# EAGLE schematic RGB-LED-dimmer (EAGLE 7.4.0)
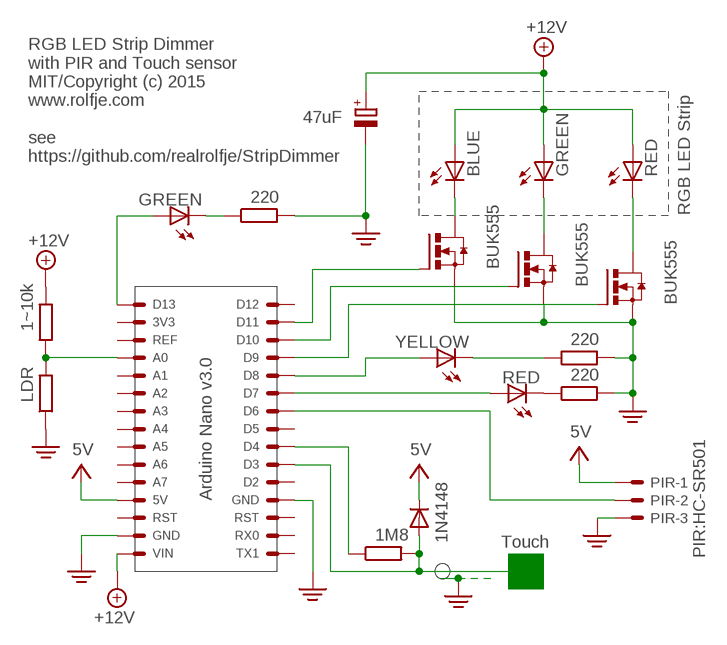
[diagram p0: schematic, sheet 1]

## Parts
A  C-GRID-15-70543  [70543-15]
B  C-GRID-15-70543  [70543-15]
BLUE  LED5MM  [LED5MM]
C1  47uF  CPOL-EUE2.5-5  [E2,5-5]
D1  1N4148  1N4148DO35-7  [DO35-7]
GREEN  LED5MM  [LED5MM]
LDR  LDR  R-EU_0204/7  [0204/7]
LED1  YELLOW  LED5MM  [LED5MM]
LED2  RED  LED5MM  [LED5MM]
LED3  GREEN  LED5MM  [LED5MM]
PIR  PIR:HC-SR501  C-GRID-03-70543  [70543-03]
Q1  BUK555  IRF3704L-V  [TO262-V]
Q2  BUK555  IRF3704L-V  [TO262-V]
Q3  BUK555  IRF3704L-V  [TO262-V]
R1  1M8  R-EU_0204/7  [0204/7]
R2  220  R-EU_0204/7  [0204/7]
R3  220  R-EU_0204/7  [0204/7]
R4  220  R-EU_0204/7  [0204/7]
R5  1~10k  R-EU_0204/7  [0204/7]
RED  LED5MM  [LED5MM]

## Nets
+12V: A.15 BLUE.A C1.+ GREEN.A R5.2 RED.A
N$1: Q1.2(D) RED.K(C)
N$2: GREEN.K(C) Q2.2(D)
N$3: BLUE.K(C) Q3.2(D)
N$4: B.9 R1.1
N$5: B.4 Q1.1(G)
N$6: B.3 Q2.1(G)
N$7: B.2 Q3.1(G)
N$8: B.10 D1.A R1.2
N$9: LED1.K(C) R2.1
N$10: LED3.K(C) R4.1
N$11: B.5 LED1.A
N$12: B.6 LED2.A
N$13: LED2.K(C) R3.1
N$14: B.7 PIR.2
N$15: A.1 LED3.A
N$16: A.4 LDR.2 R5.1
PE: A.14 B.12 C1.- LDR.1 PIR.3 Q1.3(S) Q2.3(S) Q3.3(S) R2.2 R3.2 R4.2
V+: A.12 D1.C PIR.1 ; supply symbol labelled 5V
Unconnected: A.2 A.3 A.5 A.6 A.7 A.8 A.9 A.10 A.11 A.13 B.1 B.8 B.11 B.13 B.14 B.15

## Notes on the sheet
- RGB LED Strip
- RGB LED Strip Dimmer
  with PIR and Touch sensor
  MIT/Copyright (c) 2015
  www.rolfje.com
  
  see
  https://github.com/realrolfje/StripDimmer
- D13 | D12
- 3V3 | D11
- REF | D10
- A0 | D9
- A1 | D8
- A2 | D7
- A3 | D6
- A4 | Arduino Nano v3.0 | D5
- A5 | D4
- A6 | D3
- A7 | D2
- 5V | GND
- RST | RST
- GND | RX0
- Touch
- VIN | TX1

## Library data of the parts
A B = con-molex:C-GRID-15: CONNECTOR wire to board 2.54 mm (0.100") pitch header; OC_FARNELL: unknown; OC_NEWARK: unknown
BLUE GREEN LED1-LED3 RED = led:LED: LED OSRAM: - CHIPLED LG R971, LG N971, LY N971, LG Q971, LY Q971, LO R971, LY R971 LH N974, LH R974 LS Q976, LO Q976, LY Q976 LO Q996 - Hyper CHIPLED LW Q18S LB Q993, LB Q99A, LB R99A - SideLED LS A670, LO A670, LY A670, LG A670, LP A670 LB A673, LV A673, LT A673, LW A673 LH A674 LY A675 LS A676, LA A676, LO A676, LY A676, LW A676 LS A679, LY A679, LG A679 - Hyper Micro SIDELED® LS Y876, LA Y876, LO Y876, LY Y876 LT Y87S - SmartLED LW L88C, LW L88S LB L89C, LB L89S, LG L890 LS L89K, LO L89K, LY L89K LS L896, LA L896, LO L896, LY L896 - TOPLED LS T670, LO T670, LY T670, LG T670, LP T670 LSG T670, LSP T670, LSY T670, LOP T670, LYG T670 LG T671, LOG T671, LSG T671 LB T673, LV T673, LT T673, LW T673 LH T674 LS T676, LA T676, LO T676, LY T676, LB T676, LH T676, LSB T676, LW T676 LB T67C, LV T67C, LT T67C, LS T67K, LO T67K, LY T67K, LW E67C LS E67B, LA E67B, LO E67B, LY E67B, LB E67C, LV E67C, LT E67C LW T67C LS T679, LY T679, LG T679 LS T770, LO T770, LY T770, LG T770, LP T770 LB T773, LV T773, LT T773, LW T773 LH T774 LS E675, LA E675, LY E675, LS T675 LS T776, LA T776, LO T776, LY T776, LB T776 LHGB T686 LT T68C, LB T68C - Hyper Mini TOPLED® LB M676 - Mini TOPLED Santana® LG M470 LS M47K, LO M47K, LY M47K Source: http://www.osram.convergy.de LUXEON: - LUMILED® LXK2-PW12-R00, LXK2-PW12-S00, LXK2-PW14-U00, LXK2-PW14-V00 LXK2-PM12-R00, LXK2-PM12-S00, LXK2-PM14-U00 LXK2-PE12-Q00, LXK2-PE12-R00, LXK2-PE12-S00, LXK2-PE14-T00, LXK2-PE14-U00 LXK2-PB12-K00, LXK2-PB12-L00, LXK2-PB12-M00, LXK2-PB14-N00, LXK2-PB14-P00, LXK2-PB14-Q00 LXK2-PR12-L00, LXK2-PR12-M00, LXK2-PR14-Q00, LXK2-PR14-R00 LXK2-PD12-Q00, LXK2-PD12-R00, LXK2-PD12-S00 LXK2-PH12-R00, LXK2-PH12-S00 LXK2-PL12-P00, LXK2-PL12-Q00, LXK2-PL12-R00 Source: www.luxeon.com KINGBRIGHT: KA-3528ASYC Source: www.kingbright.com
C1 = resistor:CPOL-EU: POLARIZED CAPACITOR, European symbol
D1 = diode:1N4148: DIODE high speed (Philips)
LDR R1-R5 = resistor:R-EU_: RESISTOR, European symbol
PIR = con-molex:C-GRID-03: CONNECTOR wire to board 2.54 mm (0.100") pitch header; OC_FARNELL: unknown; OC_NEWARK: unknown
Q1-Q3 = transistor-power:IRF3704: SMPS MOSFET HEXFET® Power MOSFET Source: http://www.irf.com/product-info/datasheets/data/irf3704.pdf